# EAGLE design ps3-usb-hid-v11 (EAGLE 5.04)
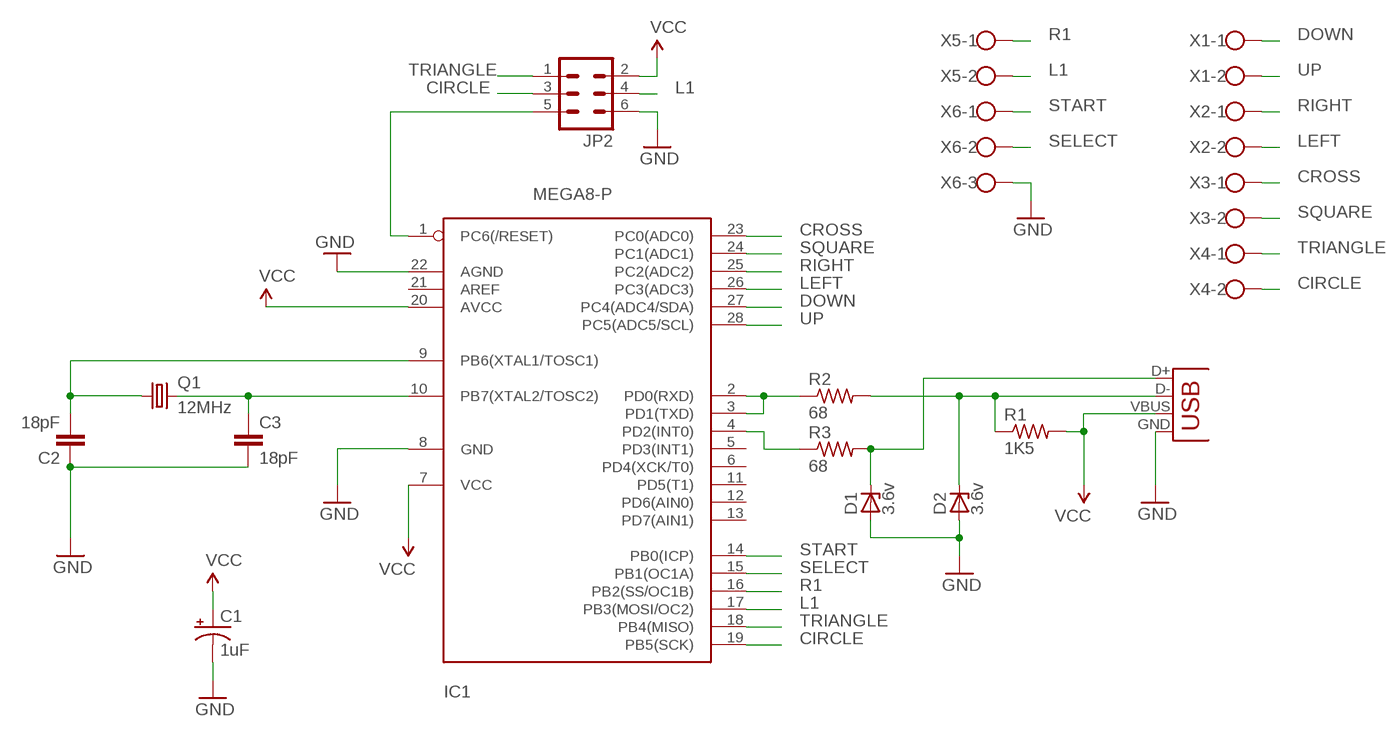
[diagram p0: schematic, sheet 1]

## Parts
C1  1uF  CAP_POLPTH2  [CPOL-RADIAL-10UF-25V]
C2  18pF  CAPPTH  [CAP-PTH-SMALL]
C3  18pF  CAPPTH  [CAP-PTH-SMALL]
D1  3.6v  ZENER-DIODEDO35Z10  [DO35Z10]
D2  3.6v  ZENER-DIODEDO35Z10  [DO35Z10]
IC1  MEGA8-P  [DIL28-3]
JP1  USBPTH  [USB-B-PTH]
JP2  MA03-2  [MA03-2]
Q1  12MHz  CRYSTALHC49S  [HC49/S]
R1  1K5  R-US_0207/10  [0207/10]
R2  68  R-US_0207/10  [0207/10]
R3  68  R-US_0207/10  [0207/10]
X1  W237-102  [W237-102]
X2  W237-102  [W237-102]
X3  W237-102  [W237-102]
X4  W237-102  [W237-102]
X5  W237-102  [W237-102]
X6  W237-103  [W237-103]

## Nets
CIRCLE: IC1.19(PB5(SCK)) JP2.3 X4.2
CROSS: IC1.23(PC0(ADC0)) X3.1
DOWN: IC1.27(PC4(ADC4/SDA)) X1.1
GND: C1.2(-) C2.1 C3.2 D1.A D2.A IC1.8(GND) IC1.22(AGND) JP1.GND JP2.6 X6.3
L1: IC1.17(PB3(MOSI/OC2)) JP2.4 X5.2
LEFT: IC1.26(PC3(ADC3)) X2.2
N$1: C2.2 IC1.9(PB6(XTAL1/TOSC1)) Q1.1
N$2: C3.1 IC1.10(PB7(XTAL2/TOSC2)) Q1.2
N$3: IC1.2(PD0(RXD)) IC1.3(PD1(TXD)) R2.1
N$4: IC1.1(PC6(/RESET)) JP2.5
N$5: D2.C JP1.D- R1.1 R2.2
N$6: IC1.4(PD2(INT0)) R3.1
N$7: D1.C JP1.D+ R3.2
R1: IC1.16(PB2(SS/OC1B)) X5.1
RIGHT: IC1.25(PC2(ADC2)) X2.1
SELECT: IC1.15(PB1(OC1A)) X6.2
SQUARE: IC1.24(PC1(ADC1)) X3.2
START: IC1.14(PB0(ICP)) X6.1
TRIANGLE: IC1.18(PB4(MISO)) JP2.1 X4.1
UP: IC1.28(PC5(ADC5/SCL)) X1.2
VCC: C1.1(+) IC1.7(VCC) IC1.20(AVCC) JP1.VBUS JP2.2 R1.2
Unconnected: IC1.5(PD3(INT1)) IC1.6(PD4(XCK/T0)) IC1.11(PD5(T1)) IC1.12(PD6(AIN0)) IC1.13(PD7(AIN1)) IC1.21(AREF)

## Library data of the parts
C1 = SparkFun:CAP_POL: Capacitor Polarized These are standard SMD and PTH capacitors. Normally 10uF, 47uF, and 100uF in electrolytic and tantalum varieties. Always verify the external diameter of the through hole cap, it varies with capacity, voltage, and manufacturer. The EIA devices should be standard.
C2 C3 = SparkFun:CAP: Capacitor Standard 0603 ceramic capacitor, and 0.1" leaded capacitor.
D1 D2 = diode:ZENER-DIODE: Z-Diode
IC1 = atmel:MEGA8-P: MICROCONTROLLER 8 Kbytes FLASH, 1 kbytes SRAM, 512 bytes EEPROM, USART, 4-channel 10 bit ADC, 2-channel 8 bit ADC Pin compatible with Atmega48, ATMega88, ATMega168 Source: avr.lbr
JP1 = SparkFun:USB: USB Connectors USB-B-PTH is fully proven SKU : PRT-00139 USB-miniB is fully proven SKU : PRT-00587 USB-A-PCB is untested. USB-A-H is throughly reviewed, but untested. Spark Fun Electronics SKU : PRT-00437 USB-B-SMT is throughly reviewed, but untested. Needs silkscreen touching up. USB-A-S has not been used/tested USB-MB-H has not been used/tested
JP2 = con-lstb:MA03-2: PIN HEADER
Q1 = crystal:CRYSTAL: CRYSTAL
R1-R3 = resistor:R-US_: RESISTOR, American symbol
X1-X5 = con-wago-500:W237-102: WAGO SCREW CLAMP
X6 = con-wago-500:W237-103: WAGO SCREW CLAMP

## Board
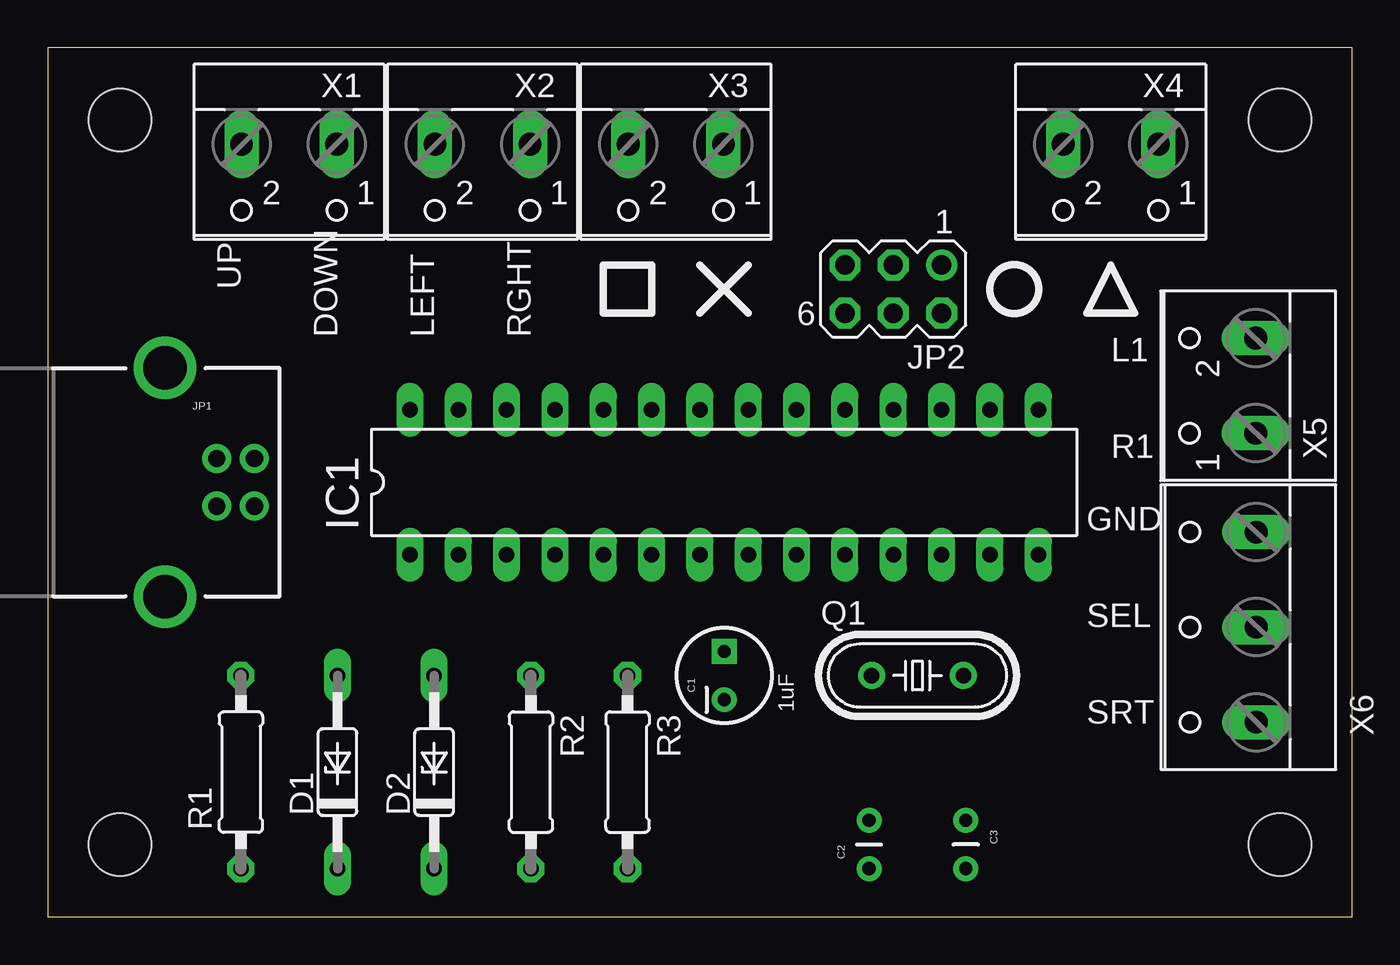
[diagram p1: board, top side]
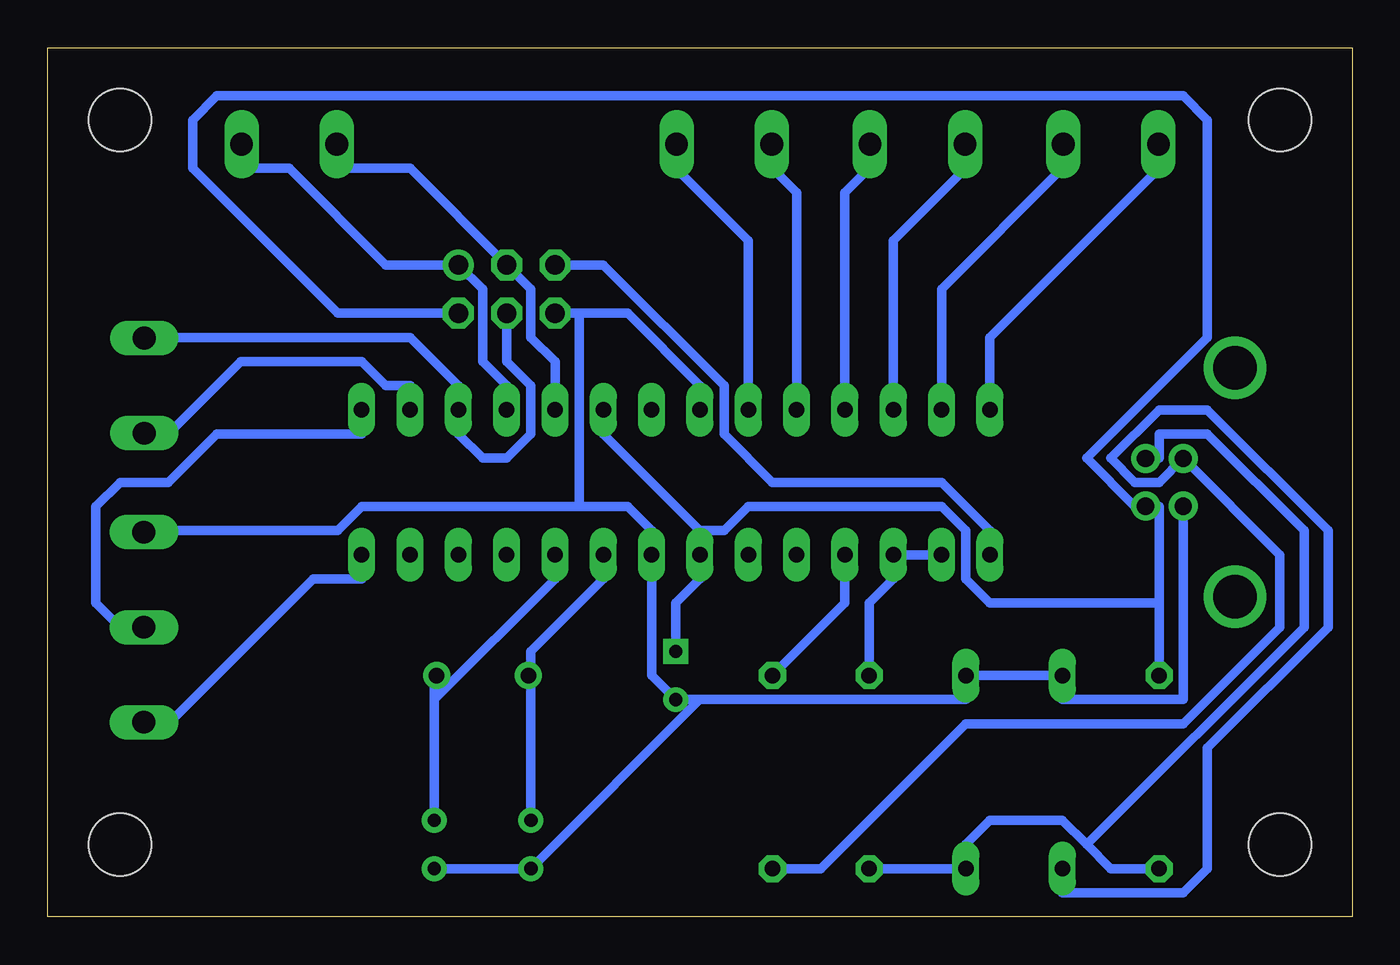
[diagram p2: board, bottom side, seen from below]

Size 68.58 x 45.72 mm. Coordinates in mm from the lower left corner, seen from the top.
Outline: 0,0 68.58,0 68.58,45.72 0,45.72 0,0
Copper layers (1*16): Top 0.035mm / dielectric 1.5mm / Bottom 0.035mm
Design rules "default *": minimum track width 20mil, minimum drill 24mil, track to track 8mil, track to pad 8mil, pad to pad 8mil, via to via 8mil, smd to smd 8mil, copper to edge 40mil, drill to drill 8mil, minimum pad ring 12mil, minimum via ring 8mil, stop-mask expansion 4mil, vias tented up to drill 0mil, thermal gap 10mil

### Footprints (pad centres in the part's own frame; a part is rotated, then mirrored left to right if it is on the bottom)
CPOL-RADIAL-10UF-25V = drill 0.7 square: 1 1.27,0 | drill 0.7 round: 2 -1.27,0
CAP-PTH-SMALL = drill 0.7 round: 1 0,0; 2 2.54,0
DO35Z10 = drill 0.813 long: A 5.08,0; C -5.08,0
DIL28-3 = drill 0.813 long: 1 -16.51,-3.81; 2 -13.97,-3.81; 3 -11.43,-3.81; 4 -8.89,-3.81; 5 -6.35,-3.81; 6 -3.81,-3.81; 7 -1.27,-3.81; 8 1.27,-3.81; 9 3.81,-3.81; 10 6.35,-3.81; 11 8.89,-3.81; 12 11.43,-3.81; 13 13.97,-3.81; 14 16.51,-3.81; 15 16.51,3.81; 16 13.97,3.81; 17 11.43,3.81; 18 8.89,3.81; 19 6.35,3.81; 20 3.81,3.81; 21 1.27,3.81; 22 -1.27,3.81; 23 -3.81,3.81; 24 -6.35,3.81; 25 -8.89,3.81; 26 -11.43,3.81; 27 -13.97,3.81; 28 -16.51,3.81
USB-B-PTH = drill 0.914 round: D+ 0,1.25; D- 1.981,1.25; GND 0,-1.25; VBUS 1.981,-1.25 | drill 2.286 round: P$1 -2.718,-6.02; P$2 -2.718,6.02
MA03-2 = drill 1.016 round: 1 -2.54,-1.27 | drill 1.016 octagon: 2 -2.54,1.27; 3 0,-1.27; 4 0,1.27; 5 2.54,-1.27; 6 2.54,1.27
HC49/S = drill 0.813 round: 1 -2.413,0; 2 2.413,0
0207/10 = drill 0.813 octagon: 1 -5.08,0; 2 5.08,0
STAND-OFF = hole 3.302: 0,0
W237-102 = drill 1.194 long: 1 -2.5,-1.27; 2 2.5,-1.27
W237-103 = drill 1.194 long: 1 -5,-1.29; 2 0,-1.29; 3 5,-1.29

### Placement (x,y rotation side)
C1  35.56,12.7 90 top
C2  43.18,2.54 90 top
C3  48.26,5.08 270 top
D1  15.24,7.62 90 top
D2  20.32,7.62 90 top
IC1  35.56,22.86 0 top
JP1  8.89,22.86 0 top
JP2  44.45,33.02 180 top
Q1  45.72,12.7 0 top
R1  10.16,7.62 90 top
R2  25.4,7.62 270 top
R3  30.48,7.62 270 top
U$1  [STAND-OFF]  3.81,41.91 0 top
U$2  [STAND-OFF]  3.81,3.81 0 top
U$3  [STAND-OFF]  64.77,3.81 0 top
U$4  [STAND-OFF]  64.77,41.91 0 top
X1  12.7,39.37 180 top
X2  22.86,39.37 180 top
X3  33.02,39.37 180 top
X4  55.88,39.37 180 top
X5  62.23,27.94 90 top
X6  62.23,15.24 90 top

### Tracks (layer width: path | path; a pad name or v marks a point on that pad's centre or on a via)
CIRCLE
  Bottom 0.508: IC1.19 41.91,29.21 43.18,30.48 43.18,33.02 JP2.3 49.53,39.37 53.34,39.37 X4.2
CROSS
  Bottom 0.508: IC1.23 31.75,35.56 35.56,39.37 X3.1
DOWN
  Bottom 0.508: IC1.27 21.59,33.02 15.24,39.37 X1.1
GND
  Bottom 0.508: 40.64,31.75 JP2.6 | 40.64,31.75 38.1,31.75 34.29,27.94 IC1.22 | C3.2 C2.1 34.29,11.43 | 34.29,11.43 20.32,11.43 D2.A D1.A 15.24,11.43 8.89,11.43 JP1.GND | 34.29,11.43 C1.2 36.83,12.7 IC1.8 36.83,20.32 38.1,21.59 40.64,21.59 | 40.64,21.59 52.07,21.59 53.34,20.32 62.23,20.32 X6.3 | 40.64,21.59 40.64,31.75
L1
  Bottom 0.508: X5.2 62.23,30.48 49.53,30.48 46.99,27.94 IC1.17 46.99,25.4 45.72,24.13 44.45,24.13 43.18,25.4 43.18,27.94 44.45,29.21 JP2.4
LEFT
  Bottom 0.508: IC1.26 24.13,35.56 20.32,39.37 X2.2
N$1
  Bottom 0.508: C2.2 43.18,12.7 | 43.18,12.7 43.18,13.97 39.37,17.78 IC1.9 | 43.18,12.7 Q1.1
N$2
  Bottom 0.508: 48.26,11.43 48.26,12.7 Q1.2 | C3.1 48.26,11.43 | 48.26,11.43 41.91,17.78 IC1.10
N$3
  Bottom 0.508: IC1.2 IC1.3 24.13,17.78 25.4,16.51 R2.1
N$4
  Bottom 0.508: JP2.5 39.37,34.29 33.02,27.94 33.02,25.4 30.48,22.86 21.59,22.86 19.05,20.32 IC1.1
N$5
  Bottom 0.508: R1.1 12.7,2.54 13.97,3.81 | 13.97,3.81 15.24,5.08 19.05,5.08 20.32,3.81 D2.C R2.2 | 13.97,3.81 2.54,15.24 2.54,20.32 7.62,25.4 10.16,25.4 10.16,24.13 JP1.D-
N$6
  Bottom 0.508: R3.1 26.67,16.51 IC1.4
N$7
  Bottom 0.508: 8.89,24.13 10.16,22.86 11.43,22.86 12.7,24.13 10.16,26.67 7.62,26.67 1.27,20.32 1.27,15.24 7.62,8.89 7.62,2.54 8.89,1.27 15.24,1.27 D1.C | R3.2 27.94,2.54 20.32,10.16 8.89,10.16 3.81,15.24 3.81,19.05 8.89,24.13 | 8.89,24.13 JP1.D+
R1
  Bottom 0.508: IC1.16 49.53,27.94 50.8,27.94 52.07,29.21 58.42,29.21 62.23,25.4 X5.1
RIGHT
  Bottom 0.508: IC1.25 26.67,38.1 25.4,39.37 X2.1
SELECT
  Bottom 0.508: IC1.15 52.07,25.4 59.69,25.4 62.23,22.86 64.77,22.86 66.04,21.59 66.04,16.51 64.77,15.24 X6.2
SQUARE
  Bottom 0.508: IC1.24 29.21,38.1 30.48,39.37 X3.2
START
  Bottom 0.508: IC1.14 52.07,17.78 54.61,17.78 62.23,10.16 X6.1
TRIANGLE
  Bottom 0.508: IC1.18 44.45,27.94 45.72,29.21 45.72,33.02 JP2.1 50.8,34.29 55.88,39.37 58.42,39.37 X4.1
UP
  Bottom 0.508: IC1.28 19.05,30.48 10.16,39.37 X1.2
VCC
  Bottom 0.508: C1.1 35.56,16.51 34.29,17.78 IC1.7 34.29,20.32 | 34.29,20.32 39.37,25.4 IC1.20 | 10.16,16.51 10.16,21.59 JP1.VBUS 11.43,21.59 13.97,24.13 7.62,30.48 7.62,41.91 8.89,43.18 59.69,43.18 60.96,41.91 60.96,39.37 53.34,31.75 JP2.2 | R1.2 10.16,16.51 | 34.29,20.32 33.02,20.32 31.75,21.59 21.59,21.59 20.32,20.32 20.32,17.78 19.05,16.51 10.16,16.51

### Text on the board
tPlace: UP | DOWN | LEFT | RGHT | L1 | R1 | GND | SEL | SRT